# EAGLE design csd25310q2 (EAGLE 7.1.0)
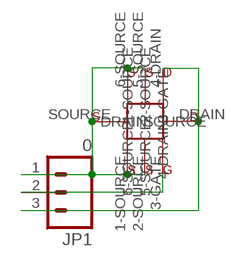
[diagram p0: schematic, sheet 1]

## Parts
JP1  0  M03SCREW  [SCREWTERMINAL-3.5MM-3]
MOSFET1  CSD25310Q2  [SON6-2MM-2MM-MOSFET]

## Nets
N$2: JP1.2 MOSFET1.3-GATE
N$3: JP1.1 MOSFET1.1-SOURCE MOSFET1.2-SOURCE MOSFET1.5-SOURCE MOSFET1.6-SOURCE MOSFET1.SOURCE
N$4: JP1.3 MOSFET1.4-DRAIN MOSFET1.DRAIN

## Library data of the parts
JP1 = SparkFun-Connectors:M03: Header 3 Standard 3-pin 0.1" header. Use with straight break away headers (SKU : PRT-00116), right angle break away headers (PRT-00553), swiss pins (PRT-00743), machine pins (PRT-00117), and female headers (PRT-00115). Molex polarized connector foot print use with SKU : PRT-08232 with associated crimp pins and housings.
MOSFET1 = awgh_mosfets:CSD25310Q2

## Net classes
0 default: width 0.076 mm

## Board
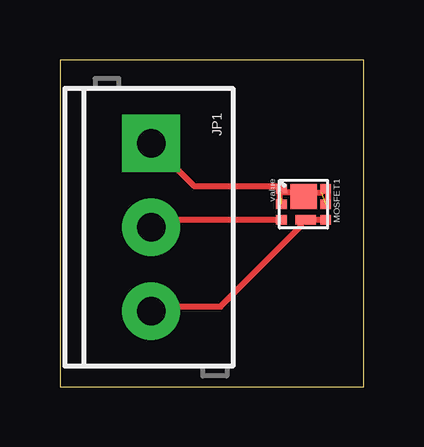
[diagram p1: board, top side]

Size 12.68 x 13.64 mm. Coordinates in mm from the lower left corner, seen from the top.
Outline: 0,0 12.68,0 12.68,13.64 0,13.64 0,0
Copper layers (1*16): Top 0.035mm / dielectric 1.5mm / Bottom 0.035mm
Design rules "default *": minimum track width 10mil, minimum drill 24mil, track to track 12mil, track to pad 12mil, pad to pad 12mil, via to via 10mil, smd to smd 12mil, copper to edge 40mil, drill to drill 8mil, minimum pad ring 10mil, minimum via ring 8mil, stop-mask expansion 4mil, vias tented up to drill 0mil, thermal gap 10mil

### Footprints (pad centres in the part's own frame; a part is rotated, then mirrored left to right if it is on the bottom)
SCREWTERMINAL-3.5MM-3 = drill 1.2 pad 2.413 square: 1 0,0 | drill 1.2 pad 2.413: 2 3.5,0; 3 7,0
SON6-2MM-2MM-MOSFET = smd 0.4 x 0.455: 1-SOURCE -0.65,-0.922; 2-SOURCE 0,-0.922; 3-GATE 0.65,-0.922; 4-DRAIN 0.65,0.922; 5-SOURCE 0,0.922; 6-SOURCE -0.65,0.922 | smd 0.4 x 0.85: DRAIN 0.65,0.096 | smd 1.05 x 1.1: SOURCE -0.325,0

### Placement (x,y rotation side)
JP1  3.81,10.16 270 top
MOSFET1  10.16,7.62 270 top

### Tracks (layer width: path | path; a pad name or v marks a point on that pad's centre or on a via)
N$1
  Top 0.254: 9.16,8.09 9.16,7.77
N$2
  Top 0.254: MOSFET1.3-GATE 9.22,6.99 4.19,6.99 3.91,6.71 JP1.2
N$3  (2 unrouted)
  Top 0.254: MOSFET1.6-SOURCE 10.9,8.1 10.34,8.1 MOSFET1.SOURCE 10.06,8.1 9.22,8.1 MOSFET1.1-SOURCE 9.22,8.38 5.59,8.38 JP1.1
N$4
  Top 0.254: MOSFET1.4-DRAIN 10.9,6.99 10.34,6.99 MOSFET1.DRAIN 10.06,6.99 10.06,6.71 6.71,3.35 3.91,3.35 JP1.3
N$5
  Top 0.254: 11.17,8.14 11.17,7.84